# EAGLE design reciver (EAGLE 5.12)
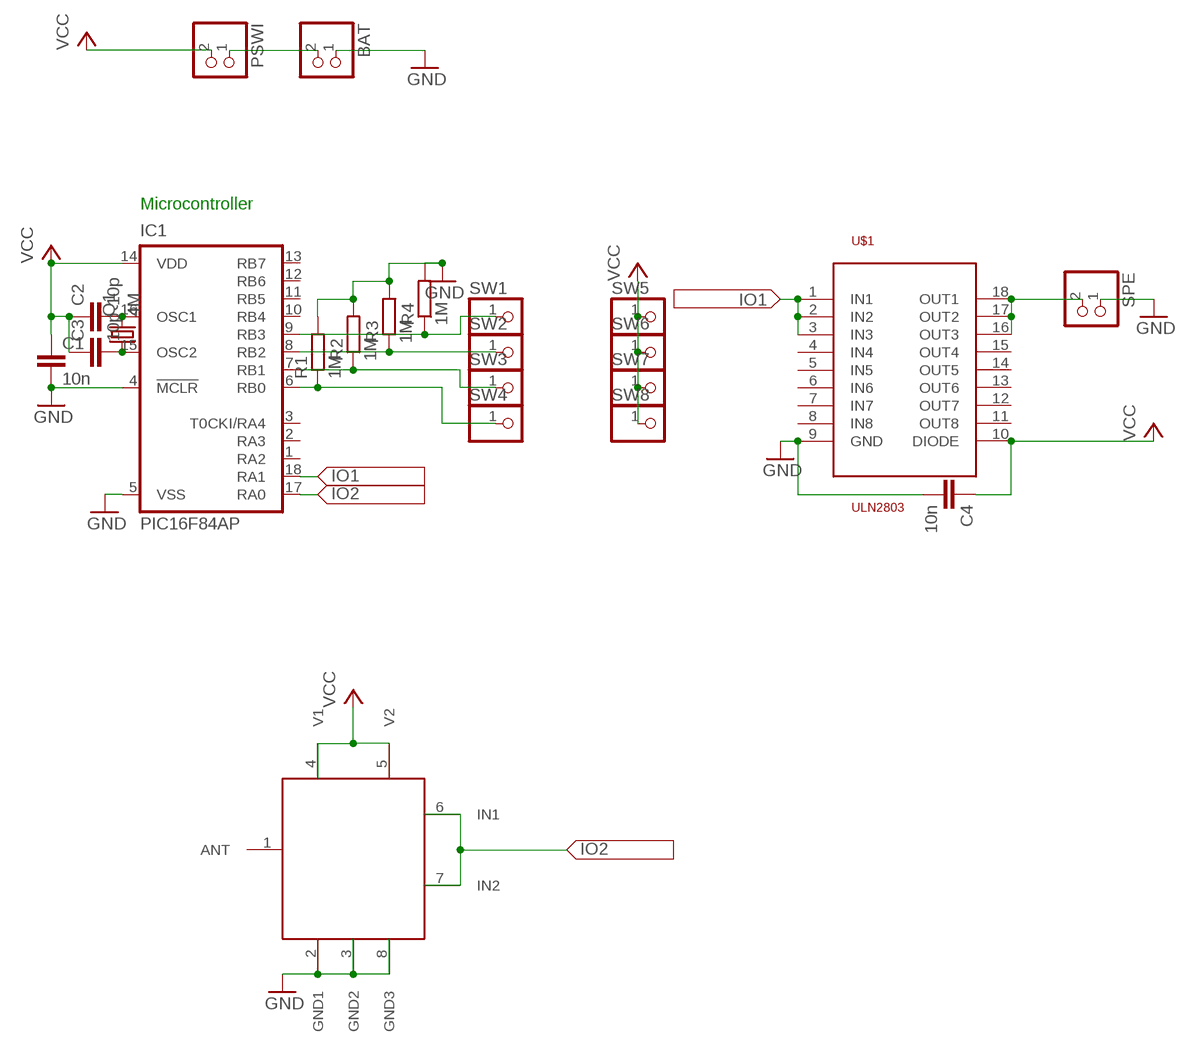
[diagram p0: schematic, sheet 1]

## Parts
BAT  PINHD-1X2  [1X02]
C1  10n  C-EUC1210  [C1210]
C2  10p  C-EUC1210  [C1210]
C3  10p  C-EUC1210  [C1210]
C4  10n  C-EUC1210  [C1210]
IC1  PIC16F84AP  [DIL18]
PSWI  PINHD-1X2  [1X02]
Q1  4M  CRYSTALSM49  [SM49]
R1  1M  R-EU_R0805  [R0805]
R2  1M  R-EU_R0805  [R0805]
R3  1M  R-EU_R0805  [R0805]
R4  1M  R-EU_R0805  [R0805]
SPE  PINHD-1X2  [1X02]
SW1  PINHD-1X1  [1X01]
SW2  PINHD-1X1  [1X01]
SW3  PINHD-1X1  [1X01]
SW4  PINHD-1X1  [1X01]
SW5  PINHD-1X1  [1X01]
SW6  PINHD-1X1  [1X01]
SW7  PINHD-1X1  [1X01]
SW8  PINHD-1X1  [1X01]
U$1  ULN2803  [DIL18]
U$2  QAM-RX2  [QAM-RX2]

## Nets
GND: BAT.1 C1.2 C4.2 IC1.4(!MCLR) IC1.5(VSS) R1.2 R2.2 R3.2 R4.2 SPE.1 U$1.9(GND) U$2.2(GND1) U$2.3(GND2) U$2.8(GND3)
IO2: IC1.17(RA0)
N1: IC1.18(RA1) U$1.1(IN1) U$1.2(IN2) U$1.3(IN3)
N$1: IC1.6(RB0) R1.1 SW4.1
N$2: IC1.7(RB1) R2.1 SW3.1
N$3: IC1.8(RB2) R3.1 SW2.1
N$4: IC1.9(RB3) R4.1 SW1.1
N$5: SPE.2 U$1.16(OUT3) U$1.17(OUT2) U$1.18(OUT1)
N$6: C2.2 IC1.16(OSC1) Q1.2
N$7: C3.2 IC1.15(OSC2) Q1.1
N$8: BAT.2 PSWI.1
N$9: U$2.6(IN1) U$2.7(IN2)
VCC: C1.1 C2.1 C3.1 C4.1 IC1.14(VDD) PSWI.2 SW5.1 SW6.1 SW7.1 SW8.1 U$1.10(DIODE) U$2.4(V1) U$2.5(V2)
Unconnected: IC1.1(RA2) IC1.2(RA3) IC1.3(T0CKI/RA4) IC1.10(RB4) IC1.11(RB5) IC1.12(RB6) IC1.13(RB7) U$1.4(IN4) U$1.5(IN5) U$1.6(IN6) U$1.7(IN7) U$1.8(IN8) U$1.11(OUT8) U$1.12(OUT7) U$1.13(OUT6) U$1.14(OUT5) U$1.15(OUT4) U$2.1(ANT)

## Notes on the sheet
- Microcontroller

## Library data of the parts
BAT PSWI SPE = pinhead:PINHD-1X2: PIN HEADER
C1-C4 = rcl:C-EU: CAPACITOR, European symbol
IC1 = microchip:PIC16F8*: MICROCONTROLLER 8-Bit PIC16F8X Family - CMOS Flash/EEPROM Pin Compatible : PIC16F83, PIC16CR83, PIC16F84A, PIC16CR84 see also PIC16C* <DEVICE:PIC16C*>; MF: MICROCHIP; MPN: PIC16F84A-04I/P; OC_FARNELL: 9760865; OC_NEWARK: 69K7635
Q1 = crystal:CRYSTAL: CRYSTAL; OC_FARNELL: unknown; OC_NEWARK: unknown
R1-R4 = rcl:R-EU_: RESISTOR, European symbol
SW1-SW8 = pinhead:PINHD-1X1: PIN HEADER
U$1 = uln2803:ULN2803
U$2 = qusar:QAM-RX2

## Board
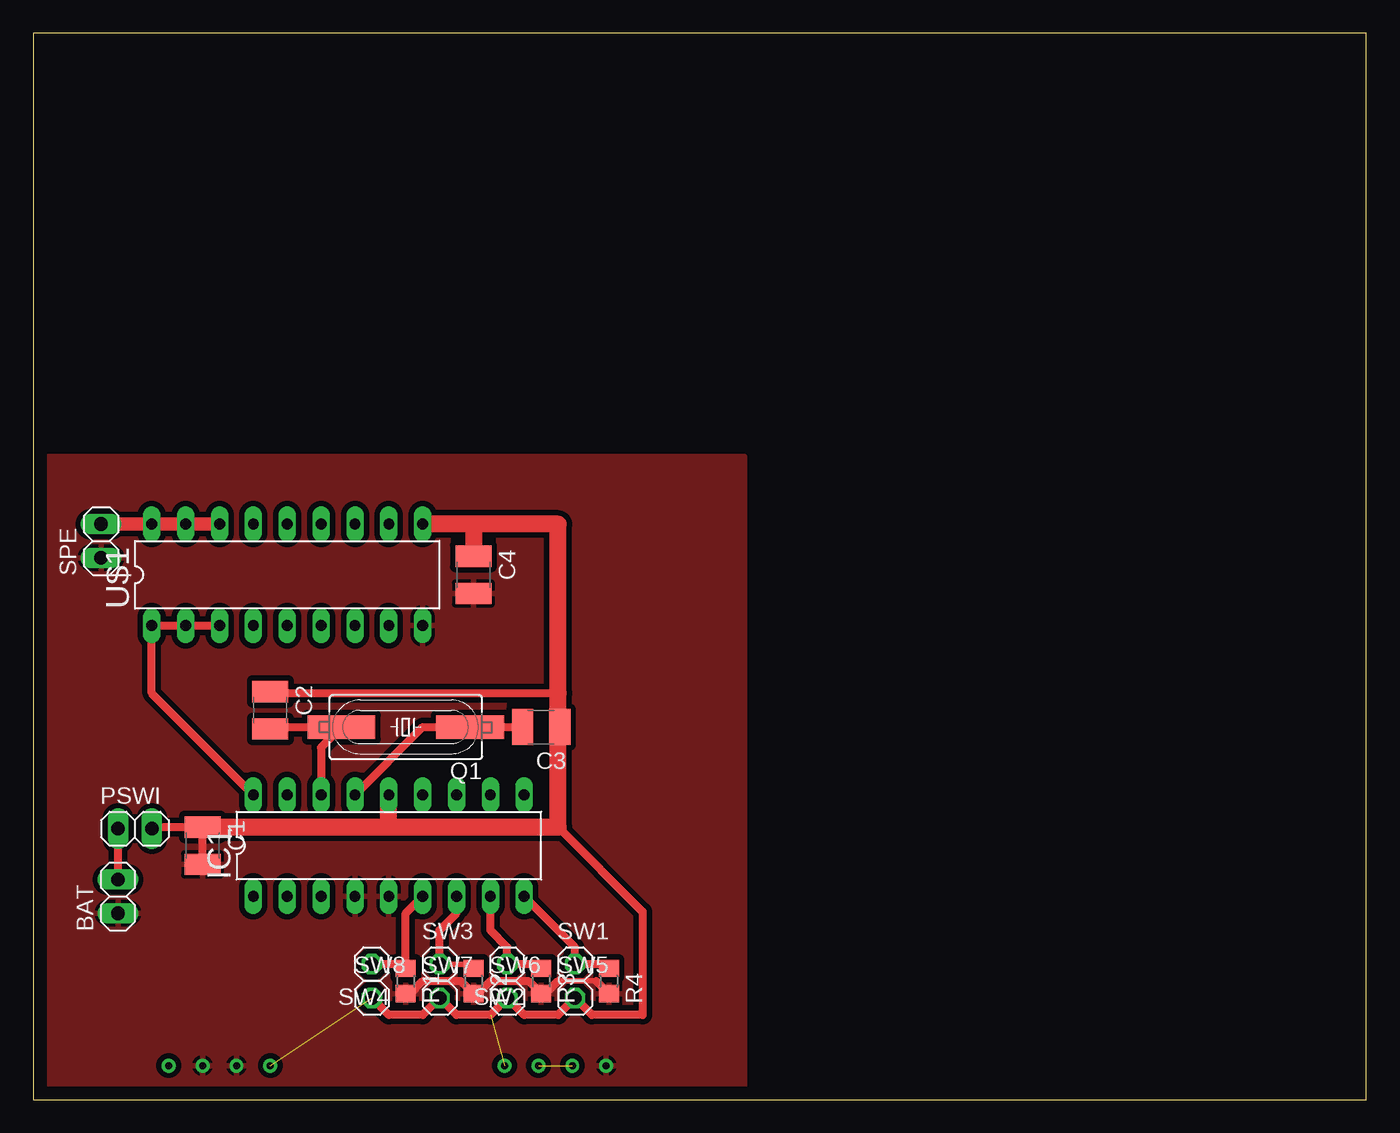
[diagram p1: board, top side]

Size 100 x 80 mm. Coordinates in mm from the lower left corner, seen from the top.
Outline: 0,0 100,0 100,80 0,80 0,0
Copper layers (1*16): Top 0.035mm / dielectric 1.5mm / Bottom 0.035mm
Design rules "default": minimum track width 10mil, minimum drill 24mil, track to track 8mil, track to pad 8mil, pad to pad 8mil, via to via 8mil, smd to smd 8mil, copper to edge 40mil, drill to drill 8mil, minimum pad ring 10mil, minimum via ring 8mil, stop-mask expansion 4mil, vias tented up to drill 0mil, thermal gap 10mil

### Footprints (pad centres in the part's own frame; a part is rotated, then mirrored left to right if it is on the bottom)
1X02 = drill 1.016 long: 1 -1.27,0; 2 1.27,0
C1210 = smd 1.6 x 2.7: 1 -1.4,0; 2 1.4,0
DIL18 = drill 0.813 long: 1 -10.16,-3.81; 2 -7.62,-3.81; 3 -5.08,-3.81; 4 -2.54,-3.81; 5 0,-3.81; 6 2.54,-3.81; 7 5.08,-3.81; 8 7.62,-3.81; 9 10.16,-3.81; 10 10.16,3.81; 11 7.62,3.81; 12 5.08,3.81; 13 2.54,3.81; 14 0,3.81; 15 -2.54,3.81; 16 -5.08,3.81; 17 -7.62,3.81; 18 -10.16,3.81
SM49 = smd 5.08 x 1.778: 1 -4.826,0; 2 4.826,0
R0805 = smd 1.3 x 1.5: 1 -0.95,0; 2 0.95,0
1X01 = drill 1.016 octagon: 1 0,0
QAM-RX2 = drill 0.53 round: 1 0,0; 2 2.54,0; 3 5.08,0; 4 7.62,0; 5 25.2,0; 6 27.74,0; 7 30.28,0; 8 32.82,0

### Placement (x,y rotation side)
BAT  6.35,15.24 90 top
C1  12.7,19.05 270 top
C2  17.78,29.21 270 top
C3  38.1,27.94 180 top
C4  33.02,39.37 270 top
IC1  26.67,19.05 0 top
PSWI  7.62,20.32 0 top
Q1  27.94,27.94 180 top
R1  27.94,8.89 270 top
R2  33.02,8.89 270 top
R3  38.1,8.89 270 top
R4  43.18,8.89 270 top
SPE  5.08,41.91 90 top
SW1  40.64,10.16 0 top
SW2  35.56,10.16 180 top
SW3  30.48,10.16 0 top
SW4  25.4,10.16 180 top
SW5  40.64,7.62 0 top
SW6  35.56,7.62 0 top
SW7  30.48,7.62 0 top
SW8  25.4,7.62 0 top
U$1  19.05,39.37 0 top
U$2  10.16,2.54 0 top

### Tracks (layer width: path | path; a pad name or v marks a point on that pad's centre or on a via)
GND
  Top 0.406: R1.2 28.26,7.94 | R2.2 33.34,7.94 | R3.2 38.42,7.94 | 39.37,8.89 42.23,8.89
  Top 0.61: C1.2 12.7,20.32 | 28.26,7.94 29.21,8.89 32.07,8.89 R2.2 | 33.34,7.94 34.29,8.89 37.15,8.89 R3.2 | 38.42,7.94 39.37,8.89 | 42.23,8.89 R4.2
  pour Top (isolate 0.406): 0,48.26 53.34,48.26 53.34,0 0,0
N1
  Top 0.61: IC1.18 8.89,30.48 U$1.1 U$1.2 U$1.3
N$1
  Top 0.406: R1.1 27.94,10.16
  Top 0.61: SW4.1 27.94,10.16 27.94,13.97 IC1.6
N$2
  Top 0.406: SW3.1 33.02,10.16 R2.1
  Top 0.61: SW3.1 30.48,12.7 31.75,13.97 IC1.7
N$3
  Top 0.406: R3.1 38.1,10.16
  Top 0.61: 38.1,10.16 SW2.1 35.56,11.43 34.29,12.7 IC1.8
N$4
  Top 0.406: R4.1 43.18,10.16
  Top 0.61: 43.18,10.16 SW1.1 40.64,11.43 IC1.9
N$5
  Top 1.016: SPE.2 U$1.18 U$1.17 U$1.16
N$6
  Top 0.61: C2.2 17.91,27.94 Q1.2 21.59,26.42 IC1.16
N$7
  Top 0.61: IC1.15 29.21,27.94 Q1.1 C3.2
N$8
  Top 0.61: BAT.2 PSWI.1
N$9  (1 unrouted)
VCC  (2 unrouted)
  Top 0.61: C3.1 39.37,29.34 39.37,30.48 17.91,30.48 C2.1 | PSWI.2 9.02,20.45 C1.1 | SW8.1 26.67,6.35 29.21,6.35 SW7.1 31.75,6.35 34.29,6.35 SW6.1 36.83,6.35 39.37,6.35 SW5.1 41.91,6.35 45.72,6.35 45.72,14.1 39.37,20.45
  Top 1.27: 33.02,43.18 39.37,43.18 39.37,30.48 39.37,20.45 26.67,20.45 | 33.02,43.18 U$1.10 | C1.1 26.67,20.45 | 26.67,20.45 IC1.14 | 33.02,43.18 C4.1